# Altium schematic sheet 301_GridPos3.SchDoc
size A2; Organization: Greenfield Tech Solutions; Address1: Molendreef 33; Address2: Ossendrecht; Address3: 4641CS; Address4: The Netherlands; SheetNumber: 2; SheetTotal: 4
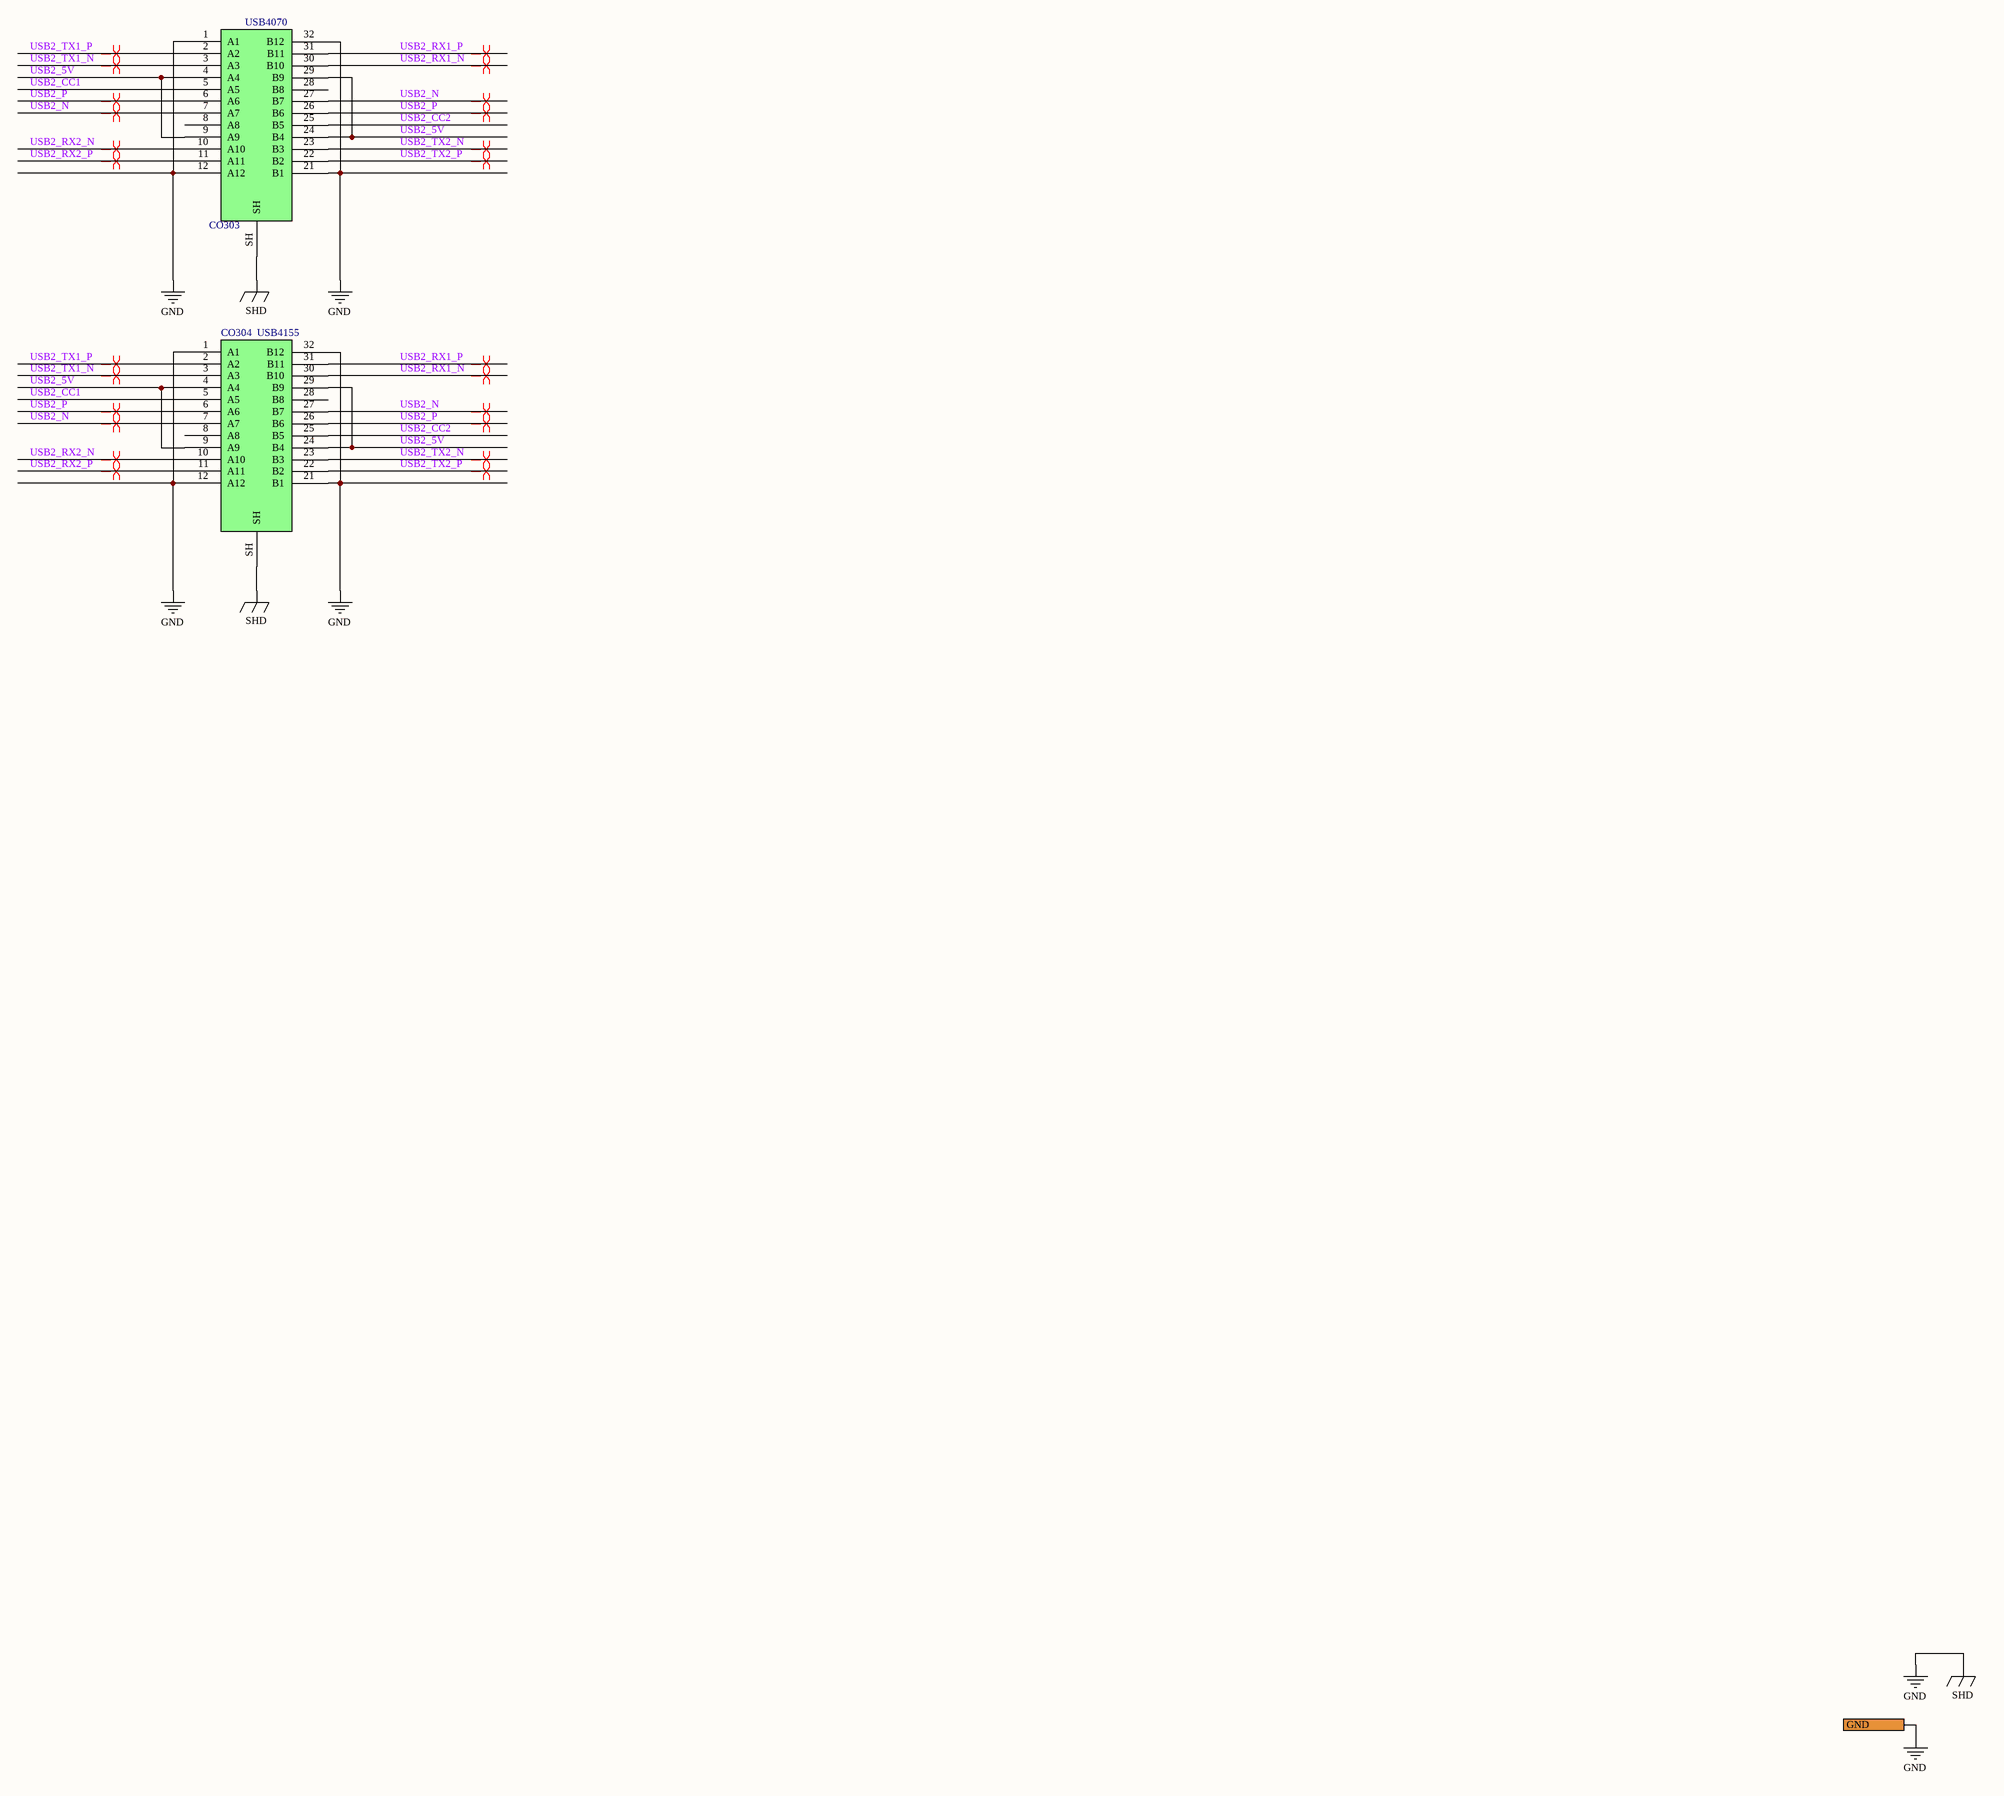
[diagram p0: 301_GridPos3.SchDoc]

## Parts
CO303  USB4070  [USB4070-30-C]
CO304  USB4155  [USB4155-03-C]

## Ports
GND

## Nets
GND: CO303.1(A1) CO303.12(A12) CO303.21(B1) CO303.32(B12) CO303.SH CO304.1(A1) CO304.12(A12) CO304.21(B1) CO304.32(B12) CO304.SH ; port GND  [also labelled SHD]
USB2_5V: CO303.4(A4) CO303.9(A9) CO303.24(B4) CO303.29(B9) CO304.4(A4) CO304.9(A9) CO304.24(B4) CO304.29(B9)
USB2_CC1: CO303.5(A5) CO304.5(A5)
USB2_CC2: CO303.25(B5) CO304.25(B5)
USB2_N: CO303.7(A7) CO303.27(B7) CO304.7(A7) CO304.27(B7)
USB2_P: CO303.6(A6) CO303.26(B6) CO304.6(A6) CO304.26(B6)
USB2_RX1_N: CO303.30(B10) CO304.30(B10)
USB2_RX1_P: CO303.31(B11) CO304.31(B11)
USB2_RX2_N: CO303.10(A10) CO304.10(A10)
USB2_RX2_P: CO303.11(A11) CO304.11(A11)
USB2_TX1_N: CO303.3(A3) CO304.3(A3)
USB2_TX1_P: CO303.2(A2) CO304.2(A2)
USB2_TX2_N: CO303.23(B3) CO304.23(B3)
USB2_TX2_P: CO303.22(B2) CO304.22(B2)

Not connected (* = marked no-connect by the designer): CO303 8(A8) 28(B8); CO304 8(A8) 28(B8)

## Layout directives
differential pair; differential pair class USB3: USB2_N, USB2_P, USB2_RX1_N, USB2_RX1_P, USB2_RX2_N, USB2_RX2_P, USB2_TX1_N, USB2_TX1_P, USB2_TX2_N, USB2_TX2_P

## Notes on the sheet
- Title
- Size:
- Date:
- File:
- A2
- Number:
- Time:
- Revision:
- Sheet
- of

## Library data of the parts
CO303 = CO0021: USB C connector Receptacle Vertical; Part Number: CO0021; ID: 16; RefVal: USB4070; ManfactPart: USB4070-30-C
CO304 = CO0031: USB C connector Plug Horizontal; Part Number: CO0031; ID: 30; RefVal: USB4155; ManfactPart: USB4155-03-C